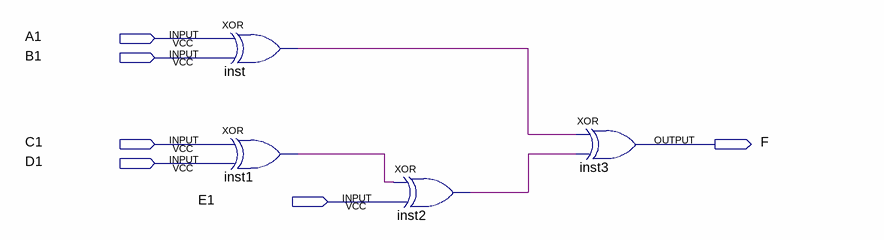
[diagram p0: schematic sheet]
// Quartus schematic xor5x1.bdf as structural Verilog: 4 symbols, 6 pins
module xor5x1 (
  input  A1,
  input  B1,
  input  C1,
  input  D1,
  input  E1,
  output F
);

  wire inst1_out, inst2_out, inst_out;

  xor inst (inst_out, A1, B1);
  xor inst1 (inst1_out, C1, D1);
  xor inst2 (inst2_out, inst1_out, E1);
  xor inst3 (F, inst_out, inst2_out);
endmodule
